# EAGLE schematic Nanobuino (EAGLE 6.5.0)
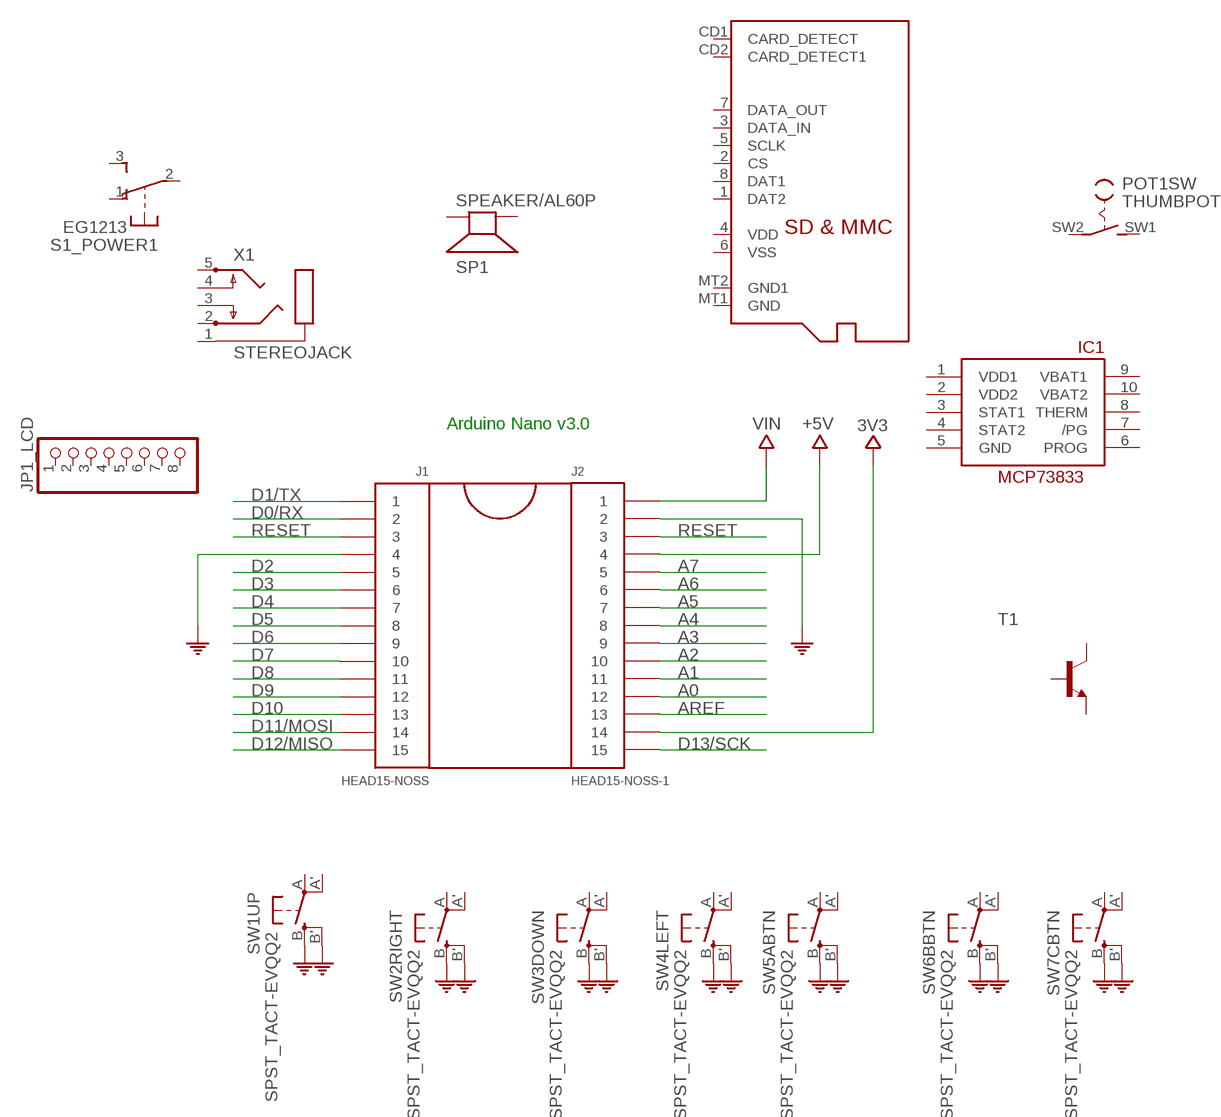
[diagram p0: schematic, sheet 1]

## Parts
IC1  MCP73833-UN  [MSOP10]
J1  HEAD15-NOSS  [HEAD15-NOSS]
J2  HEAD15-NOSS-1  [HEAD15-NOSS-1]
JP1_LCD  PINHD-1X8CLEANBIG  [1X08-CLEANBIG]
POT1  THUMBPOT  [THUMBWHEEL]
S1_POWER  EG1213  [EG1213]
SP1  SPEAKER/AL60P  [AL60P]
SW1UP  SPST_TACT-EVQQ2  [EVQ-Q2]
SW2RIGHT  SPST_TACT-EVQQ2  [EVQ-Q2]
SW3DOWN  SPST_TACT-EVQQ2  [EVQ-Q2]
SW4LEFT  SPST_TACT-EVQQ2  [EVQ-Q2]
SW5ABTN  SPST_TACT-EVQQ2  [EVQ-Q2]
SW6BBTN  SPST_TACT-EVQQ2  [EVQ-Q2]
SW7CBTN  SPST_TACT-EVQQ2  [EVQ-Q2]
T1  MMBT2222ALT1-NPN-SOT23-BEC  [SOT23-BEC]
U$20  MICROSD  [MICROSD]
X1  STEREOJACK  [STX3100]

## Nets
3V3: J2.14
+5V: J2.4
A0: J2.12
A1: J2.11
A2: J2.10
A3: J2.9
A4: J2.8
A5: J2.7
A6: J2.6
A7: J2.5
AREF: J2.13
COM: J1.4 J2.2 SW1UP.B'(S1) SW1UP.B(S) SW2RIGHT.B'(S1) SW2RIGHT.B(S) SW3DOWN.B'(S1) SW3DOWN.B(S) SW4LEFT.B'(S1) SW4LEFT.B(S) SW5ABTN.B'(S1) SW5ABTN.B(S) SW6BBTN.B'(S1) SW6BBTN.B(S) SW7CBTN.B'(S1) SW7CBTN.B(S)
D0/RX: J1.2
D1/TX: J1.1
D2: J1.5
D3: J1.6
D4: J1.7
D5: J1.8
D6: J1.9
D7: J1.10
D8: J1.11
D9: J1.12
D10: J1.13
D11/MOSI: J1.14
D12/MISO: J1.15
D13/SCK: J2.15
RESET: J1.3 J2.3
VIN: J2.1
Unconnected: IC1.3(STAT1) IC1.4(STAT2) IC1.6(PROG) IC1.7(/PG) IC1.8(THERM) IC1.9(VBAT1) IC1.10(VBAT2) JP1_LCD.1 JP1_LCD.2 JP1_LCD.3 JP1_LCD.4 JP1_LCD.5 JP1_LCD.6 JP1_LCD.7 JP1_LCD.8 POT1.1(POT:A) POT1.2(POT:S) POT1.3(POT:E) POT1.SW1(SW:S) POT1.SW2(SW:P) S1_POWER.1(1:O) S1_POWER.2(1:P) S1_POWER.3(1:S) S1_POWER.MT1(MT) S1_POWER.MT2(MT) SP1.1(+) SP1.2(-) SW1UP.A'(P1) SW1UP.A(P) SW2RIGHT.A'(P1) SW2RIGHT.A(P) SW3DOWN.A'(P1) SW3DOWN.A(P) SW4LEFT.A'(P1) SW4LEFT.A(P) SW5ABTN.A'(P1) SW5ABTN.A(P) SW6BBTN.A'(P1) SW6BBTN.A(P) SW7CBTN.A'(P1) SW7CBTN.A(P) T1.B T1.C T1.E U$20.1(DAT2) U$20.2(CS) U$20.3(DATA_IN) U$20.4(VDD) U$20.5(SCLK) U$20.6(VSS) U$20.7(DATA_OUT) U$20.8(DAT1) U$20.CD1(CARD_DETECT) U$20.CD2(CARD_DETECT1) U$20.MT1(GND) U$20.MT2(GND1) X1.1 X1.2 X1.3 X1.4 X1.5

## Notes on the sheet
- Arduino Nano v3.0

## Power pins joined to a net without a drawn wire
GND: IC1.5(GND)
VDD1: IC1.1(VDD1)
VDD2: IC1.2(VDD2)

## Library data of the parts
IC1 = adafruit:MCP73833
J1 = MyCON2:HEAD15-NOSS
J2 = MyCON2:HEAD15-NOSS-1
JP1_LCD = adafruit:PINHD-1X8: PIN HEADER
POT1 = adafruit:THUMBPOT: Thumbwheel pot with switch Available in horizontal (Alpha RV121SF) or vertical (Xicon 311-1701)
S1_POWER = adafruit:EG1213: E-Switch right-angle slide SPDT Part #EG1213 http://www.ladyada.net/library/eagle
SP1 = adafruit:SPEAKER: SPEAKER Source: Buerklin Added PS12 (for part # PS1240 piezo) http://www.ladyada.net/library/pcb/eaglelibrary.html
SW1UP SW2RIGHT SW3DOWN SW4LEFT SW5ABTN SW6BBTN SW7CBTN = adafruit:SPST_TACT: SMT 6mm switch, EVQQ2 series http://www.ladyada.net/library/eagle
T1 = transistor-neu-to92:*-NPN-: NPN Transistror
U$20 = adafruit:MICROSD: Micro-SD / Transflash card holder with SPI pinout For the 3M # 2908-05WB-MG and/or 4UCON #19656 push-push type
X1 = adafruit:STEREOJACK: MIC/HEADPHONE JACK Stereo jack with two switches. Kycon STX3100, CUI SJ1-3555NG and/or 4UCon 05544